# Altium schematic sheet Sheet1.SchDoc
size A4
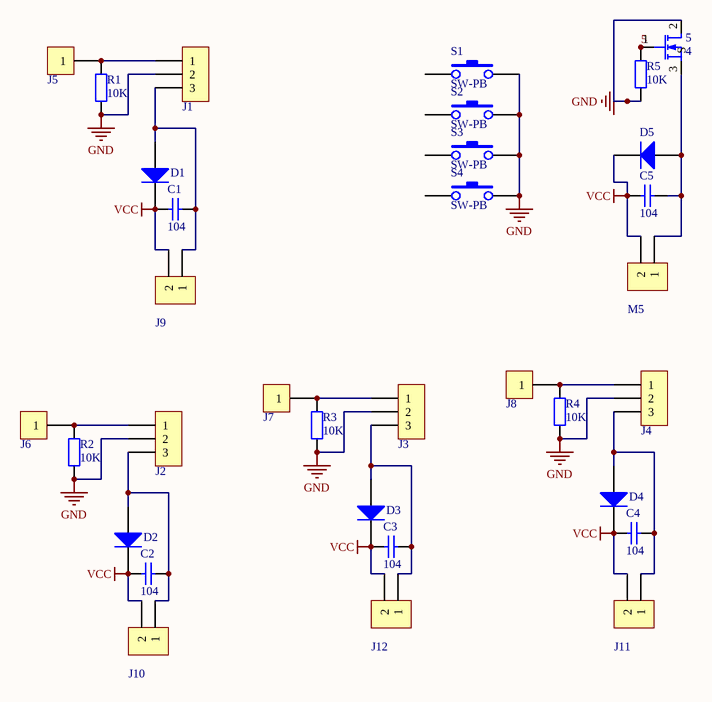
[diagram p0: Sheet1.SchDoc]

## Parts
5  4  [SOT-23]
C1  104  [C0805]
C2  104  [C0805]
C3  104  [C0805]
C4  104  [C0805]
C5  104  [0805]
D1  Diode 1N4007  [0805D]  (value not drawn)
D2  Diode 1N4007  [0805D]  (value not drawn)
D3  Diode 1N4007  [0805D]  (value not drawn)
D4  Diode 1N4007  [0805D]  (value not drawn)
D5  Diode 1N4007  [0805D]  (value not drawn)
J1  mos  [SOT-23]  (value not drawn)
J2  mos  [SOT-23]  (value not drawn)
J3  mos  [SOT-23]  (value not drawn)
J4  mos  [SOT-23]  (value not drawn)
J5  CON1  [DG1281-5.0]  (value not drawn)
J6  CON1  [DG1281-5.0]  (value not drawn)
J7  CON1  [DG1281-5.0]  (value not drawn)
J8  CON1  [DG1281-5.0]  (value not drawn)
J9  CON2  [PCBComponent_1]  (value not drawn)
J10  CON2  [PCBComponent_1]  (value not drawn)
J11  CON2  [PCBComponent_1]  (value not drawn)
J12  CON2  [PCBComponent_1]  (value not drawn)
M5  CON2  [SIP2]  (value not drawn)
R1  value 10K  [0805]  (hidden comment: Res2)
R2  value 10K  [0805]  (hidden comment: Res2)
R3  value 10K  [0805]  (hidden comment: Res2)
R4  value 10K  [0805]  (hidden comment: Res2)
R5  value 10K  [0805]  (hidden comment: Res2)
S1  SW-PB  [AXIAL0.3]
S2  SW-PB  [AXIAL0.3]
S3  SW-PB  [AXIAL0.3]
S4  SW-PB  [AXIAL0.3]

## Nets
GND: 5.2(D) J1.2 J2.2 J3.2 J4.2 R1.1 R2.1 R3.1 R4.1 R5.1 S1.2 S2.2 S3.2 S4.2
VCC: C1.1 C2.1 C3.1 C4.1 C5.1 D1.2(K) D2.2(K) D3.2(K) D4.2(K) D5.2(K) J9.2 J10.2 J11.2 J12.2 M5.2
5: 5.1(G) R5.2
Net5_3: 5.3(S) C5.2 D5.1(A) M5.1
NetC1_2: C1.2 D1.1(A) J1.3 J9.1
NetC2_2: C2.2 D2.1(A) J2.3 J10.1
NetC3_2: C3.2 D3.1(A) J3.3 J12.1
NetC4_2: C4.2 D4.1(A) J4.3 J11.1
NetJ1_1: J1.1 J5.1 R1.2
NetJ2_1: J2.1 J6.1 R2.2
NetJ3_1: J3.1 J7.1 R3.2
NetJ4_1: J4.1 J8.1 R4.2

Not connected (* = marked no-connect by the designer): S1 1; S2 1; S3 1; S4 1

## Library data of the parts
5 = IRF840: N-MOSFET
C1-C5 = Cap: Capacitor; Published: 8-Jun-2000; LatestRevisionDate: 17-Jul-2002; LatestRevisionNote: Re-released for DXP Platform.; PackageReference: RAD-0.3; Publisher: Altium Limited
D1-D5 = Diode 1N4007: 1 Amp General Purpose Rectifier; Published: 8-Jun-2000; LatestRevisionDate: 17-Jul-2002; LatestRevisionNote: Re-released for DXP Platform.; DatasheetVersion: 1998; PackageVersion: Aug-1999; PackageReference: DO-41; Publisher: Altium Limited; Code_JEDEC: DO-204-AL; ComponentLink1Description: Manufacturer Link; ComponentLink1URL: http://www.fairchildsemi.com/; ComponentLink2Description: Datasheet; ComponentLink2URL: http://www.fairchildsemi.com/ds/1N%2F1N4001.pdf
J1-J4 = CON3
R1-R5 = Res2: Resistor; Published: 8-Jun-2000; LatestRevisionDate: 17-Jul-2002; LatestRevisionNote: Re-released for DXP Platform.; PackageReference: AXIAL-0.4; Publisher: Altium Limited